# Altium schematic sheet Block Diagram.SchDoc: Science - 1_Block-Diagram
size Letter; DrawnBy: Christopher Arjune; Organization: UW Robotics; Address1: 200 University Avenue; Address2: Waterloo; Address3: Ontario; Address4: Canada N2L 3G6; SheetNumber: 1; SheetTotal: 6
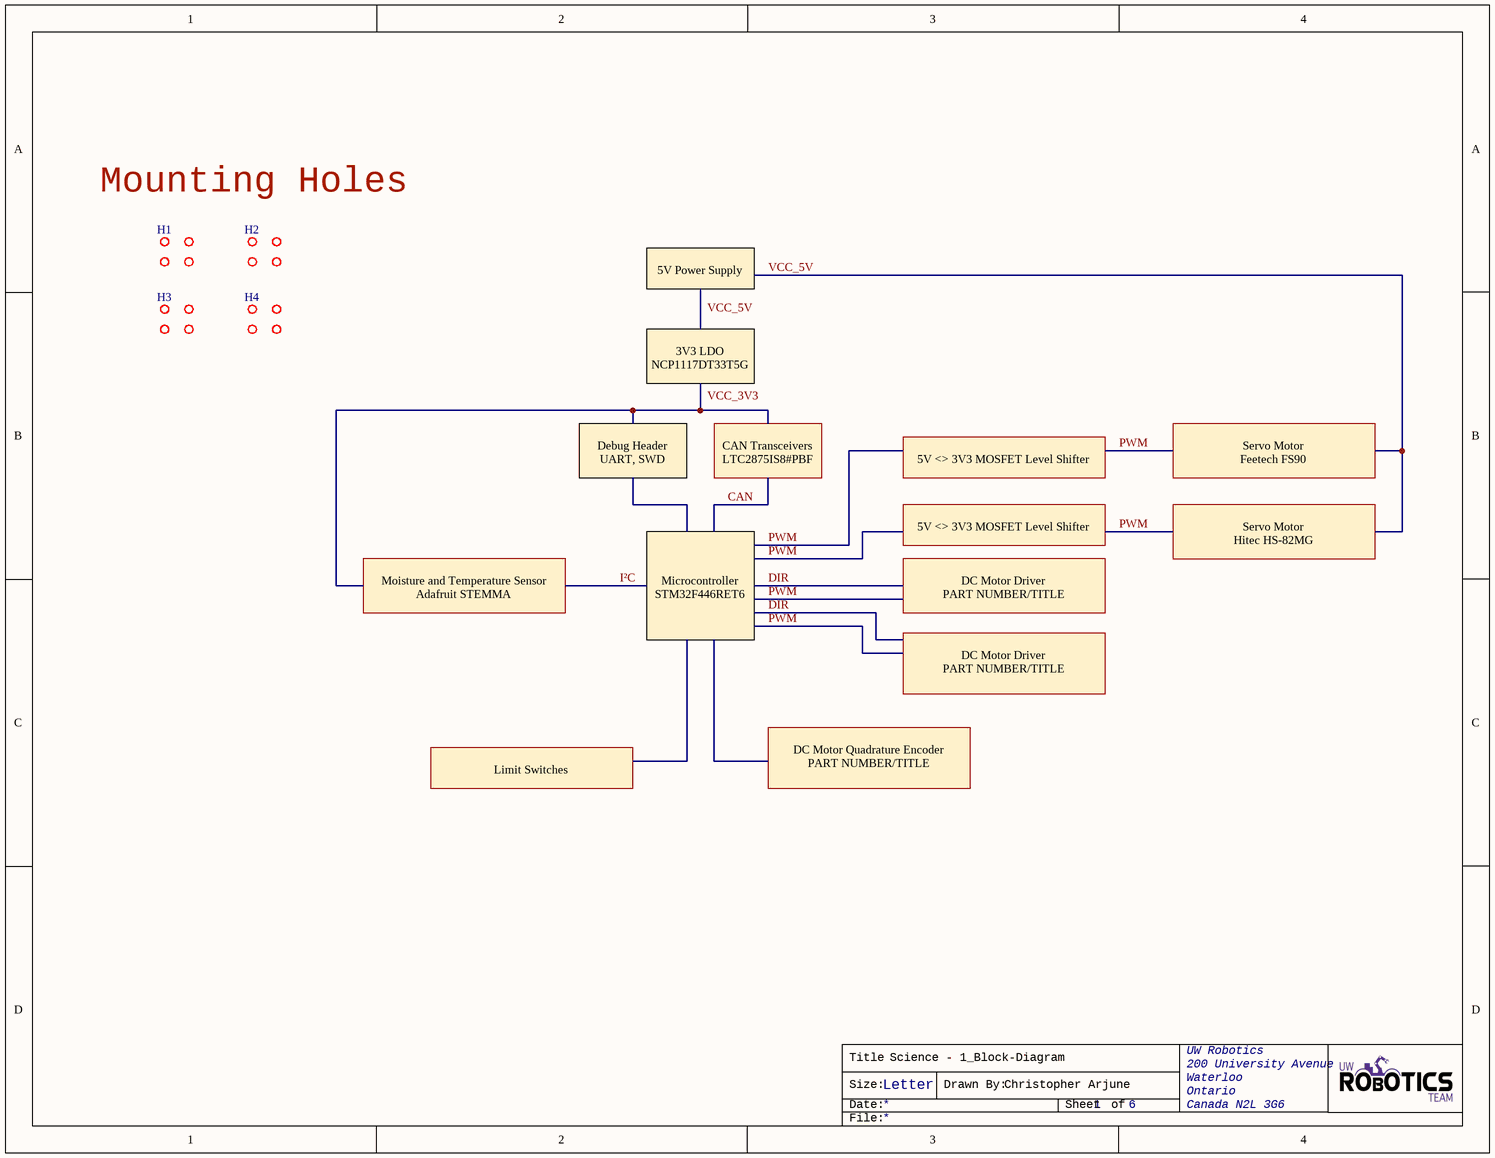
[diagram p0: Block Diagram.SchDoc]

## Parts
H1  MOUNTING_HOLES  [MOUNTING_HOLE]  (value not drawn)
H2  MOUNTING_HOLES  [MOUNTING_HOLE]  (value not drawn)
H3  MOUNTING_HOLES  [MOUNTING_HOLE]  (value not drawn)
H4  MOUNTING_HOLES  [MOUNTING_HOLE]  (value not drawn)

## Notes on the sheet
- Mounting Holes
- 5V Power Supply
- 3V3 LDO
  NCP1117DT33T5G
- Debug Header
  UART, SWD
- CAN Transceivers
  LTC2875IS8#PBF
- 5V <> 3V3 MOSFET Level Shifter
- Servo Motor
  Feetech FS90
- Servo Motor
  Hitec HS-82MG
- Moisture and Temperature Sensor
  Adafruit STEMMA
- Microcontroller
  STM32F446RET6
- DC Motor Driver
  PART NUMBER/TITLE
- Limit Switches
- DC Motor Quadrature Encoder
  PART NUMBER/TITLE
- Labels drawn without touching a wire or pin: VCC_3V3, VCC_5V
- Title
- Size:
- Date:
- Letter
- Drawn By:
- Sheet
- of
- File:

## Library data of the parts
H1-H4 = MOUNTING_HOLES: 6cm x 6cm